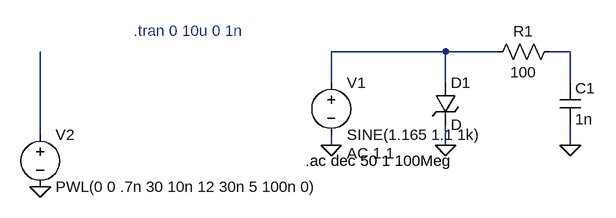
[diagram p0: schematic Design1_Vinpp_1V_R100_C220p.asc]
Design1_Vinpp_1V_R100_C220p.asc, the LTspice schematic file:
Version 4.1
SHEET 1 880 680
WIRE 240 48 64 48
WIRE 320 48 240 48
WIRE 432 48 400 48
WIRE 64 96 64 48
WIRE 240 96 240 48
WIRE 432 96 432 48
WIRE -384 176 -384 48
WIRE 64 192 64 176
WIRE 240 192 240 160
WIRE 432 192 432 160
FLAG 240 192 0
FLAG 432 192 0
FLAG 64 192 0
FLAG -384 256 0
SYMBOL voltage 64 80 R0
WINDOW 123 24 124 Left 2
WINDOW 39 0 0 Left 0
SYMATTR InstName V1
SYMATTR Value SINE(1.165 1.1 1k)
SYMATTR Value2 AC 1.1
SYMBOL TVSdiode 224 96 R0
SYMATTR InstName D1
SYMBOL res 416 32 R90
WINDOW 0 0 56 VBottom 2
WINDOW 3 32 56 VTop 2
SYMATTR InstName R1
SYMATTR Value 100
SYMBOL cap 416 96 R0
SYMATTR InstName C1
SYMATTR Value 1n
SYMBOL voltage -384 160 R0
WINDOW 123 0 0 Left 0
WINDOW 39 0 0 Left 0
SYMATTR InstName V2
SYMATTR Value PWL(0 0 .7n 30 10n 12 30n 5 100n 0)
TEXT 24 216 Left 2 !.ac dec 50 1 100Meg
TEXT -240 16 Left 2 ;.tran 0 10u 0 1n

The netlist it stands for:
* Design1_Vinpp_1V_R100_C220p.asc
V1 N001 0 SINE(1.165 1.1 1k) AC 1.1
D1 N001 0 D
R1 N002 N001 100
C1 N002 0 1n
V2 N003 0 PWL(0 0 .7n 30 10n 12 30n 5 100n 0)
.model D D
.lib standard.dio
.ac dec 50 1 100Meg
* .tran 0 10u 0 1n
.backanno
.end